# EAGLE design keyer (EAGLE 7.5.0)
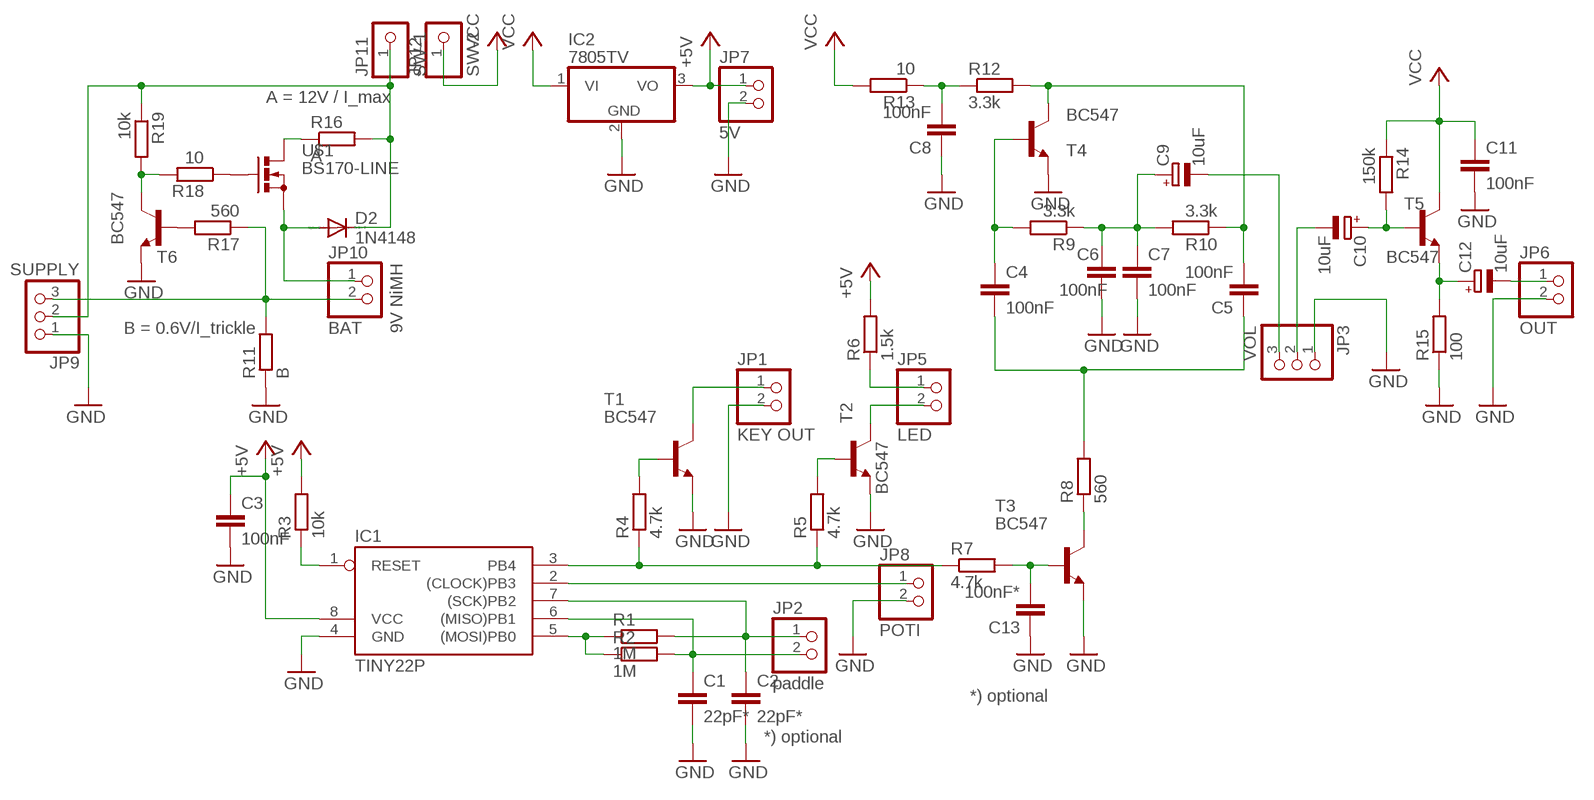
[diagram p0: schematic, sheet 1]

## Parts
C1  22pF*  C-EU050-025X075  [C050-025X075]
C2  22pF*  C-EU050-025X075  [C050-025X075]
C3  100nF  C-EU075-032X103  [C075-032X103]
C4  100nF  C-EU025-025X050  [C025-025X050]
C5  100nF  C-EU025-025X050  [C025-025X050]
C6  100nF  C-EU025-025X050  [C025-025X050]
C7  100nF  C-EU025-025X050  [C025-025X050]
C8  100nF  C-EU025-025X050  [C025-025X050]
C9  10uF  CPOL-EUE2.5-6  [E2,5-6]
C10  10uF  CPOL-EUE2.5-6  [E2,5-6]
C11  100nF  C-EU025-025X050  [C025-025X050]
C12  10uF  CPOL-EUE2.5-6  [E2,5-6]
C13  100nF*  C-EU025-025X050  [C025-025X050]
D2  1N4148  DIODE-D-2.5  [D-2.5]
IC1  TINY22P  [DIL08]
IC2  7805TV  [TO220V]
JP1  KEY OUT  PINHD-1X2  [1X02]
JP2  paddle  PINHD-1X2  [1X02]
JP3  VOL  PINHD-1X3  [1X03]
JP5  LED  PINHD-1X2  [1X02]
JP6  OUT  PINHD-1X2  [1X02]
JP7  5V  PINHD-1X2  [1X02]
JP8  POTI  PINHD-1X2  [1X02]
JP9  SUPPLY  PINHD-1X3  [1X03]
JP10  BAT  PINHD-1X2  [1X02]
JP11  SW-1  PINHD-1X1  [1X01]
JP12  SW-2  PINHD-1X1  [1X01]
R1  1M  R-EU_0204/5  [0204/5]
R2  1M  R-EU_0204/2V  [0204V]
R3  10k  R-EU_0204/5  [0204/5]
R4  4.7k  R-EU_0204/5  [0204/5]
R5  4.7k  R-EU_0204/5  [0204/5]
R6  1.5k  R-EU_0204/5  [0204/5]
R7  4.7k  R-EU_0204/5  [0204/5]
R8  560  R-EU_0204/2V  [0204V]
R9  3.3k  R-EU_0204/5  [0204/5]
R10  3.3k  R-EU_0204/7  [0204/7]
R11  B  R-EU_0204/5  [0204/5]
R12  3.3k  R-EU_0204/5  [0204/5]
R13  10  R-EU_0204/2V  [0204V]
R14  150k  R-EU_0204/2V  [0204V]
R15  100  R-EU_0204/7  [0204/7]
R16  A  R-EU_0204/2V  [0204V]
R17  560  R-EU_0204/5  [0204/5]
R18  10  R-EU_0204/5  [0204/5]
R19  10k  R-EU_0204/2V  [0204V]
T1  BC547  -NPN-TO92-CBE  [TO92-CBE]
T2  BC547  -NPN-TO92-CBE  [TO92-CBE]
T3  BC547  -NPN-TO92-CBE  [TO92-CBE]
T4  BC547  -NPN-TO92-CBE  [TO92-CBE]
T5  BC547  -NPN-TO92-CBE  [TO92-CBE]
T6  BC547  -NPN-TO92-CBE  [TO92-CBE]
U$1  BS170-LINE  [TO92-LINE]

## Nets
+5V: C3.1 IC1.8(VCC) IC2.3(VO) JP7.1 R3.2 R6.2
GND: C1.2 C2.2 C3.2 C6.2 C7.2 C8.1 C11.2 C13.1 IC1.4(GND) IC2.2(GND) JP1.2 JP3.1 JP6.2 JP7.2 JP8.2 JP9.1 R11.1 R15.1 T1.E T2.E T3.E T4.E T6.E
N$1: IC1.5((MOSI)PB0) R1.1 R2.1
N$2: C2.1 IC1.7((SCK)PB2) JP2.1 R1.2
N$3: C1.1 IC1.6((MISO)PB1) JP2.2 R2.2
N$4: IC1.1(RESET) R3.1
N$5: IC1.2((CLOCK)PB3) JP8.1
N$6: R4.2 T1.B
N$7: JP1.1 T1.C
N$8: IC1.3(PB4) R4.1 R5.1 R7.1
N$9: R8.1 T3.C
N$10: R5.2 T2.B
N$11: JP5.2 T2.C
N$12: JP5.1 R6.1
N$13: C4.1 R9.2 T4.B
N$14: C13.2 R7.2 T3.B
N$15: C5.2 R10.1 R12.2 T4.C
N$16: JP9.3 JP10.2 R11.2 R17.1
N$17: C6.1 C7.1 C9.+ R9.1 R10.2
N$18: C4.2 C5.1 R8.2
N$19: C8.2 R12.1 R13.1
N$20: C9.- JP3.3
N$21: C10.- JP3.2
N$22: C10.+ R14.2 T5.B
N$23: C12.+ R15.2 T5.E
N$24: C12.- JP6.1
N$25: R17.2 T6.B
N$26: D2.A JP10.1 U$1.1(S)
N$27: R16.1 U$1.3(D)
N$28: R18.1 U$1.2(G)
N$29: R18.2 R19.2 T6.C
N$30: D2.C JP9.2 JP11.1 R16.2 R19.1
VCC: C11.1 IC2.1(VI) JP12.1 R13.2 R14.1 T5.C

## Notes on the sheet
- A = 12V / I_max
- 9V NiMH
- B = 0.6V/I_trickle
- *) optional
- *) optional

## Library data of the parts
C1-C8 C11 C13 = rcl:C-EU: CAPACITOR, European symbol
C9 C10 C12 = rcl:CPOL-EU: POLARIZED CAPACITOR, European symbol
D2 = diode:DIODE-: DIODE
IC1 = atmel:TINY22: MICROCONTROLLER 1K ROM 128 bytes RAM 128 bytes EEPROM; OC_FARNELL: unknown; OC_NEWARK: unknown
IC2 = linear:78*: Positive VOLTAGE REGULATOR Source: http://cache.national.com/ds/LM/LM78L05.pdf http://www.fairchildsemi.com/ds/LM/LM7805.pdf
JP1 JP2 JP5-JP8 JP10 = pinhead:PINHD-1X2: PIN HEADER
JP3 JP9 = pinhead:PINHD-1X3: PIN HEADER
JP11 JP12 = pinhead:PINHD-1X1: PIN HEADER
R1-R19 = rcl:R-EU_: RESISTOR, European symbol
T1-T6 = transistor-neu-to92:*-NPN-: NPN Transistror
U$1 = transistor-small-signal:BS170-LINE

## Board
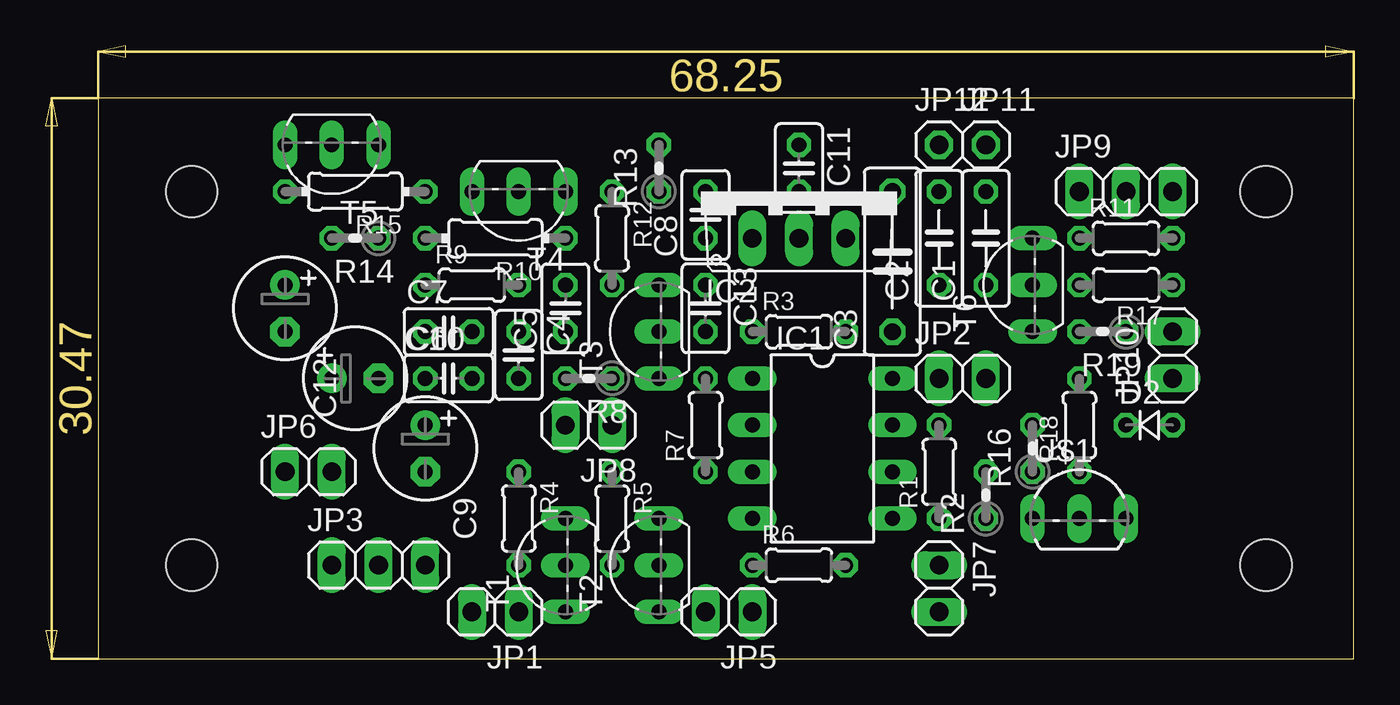
[diagram p1: board, top side]
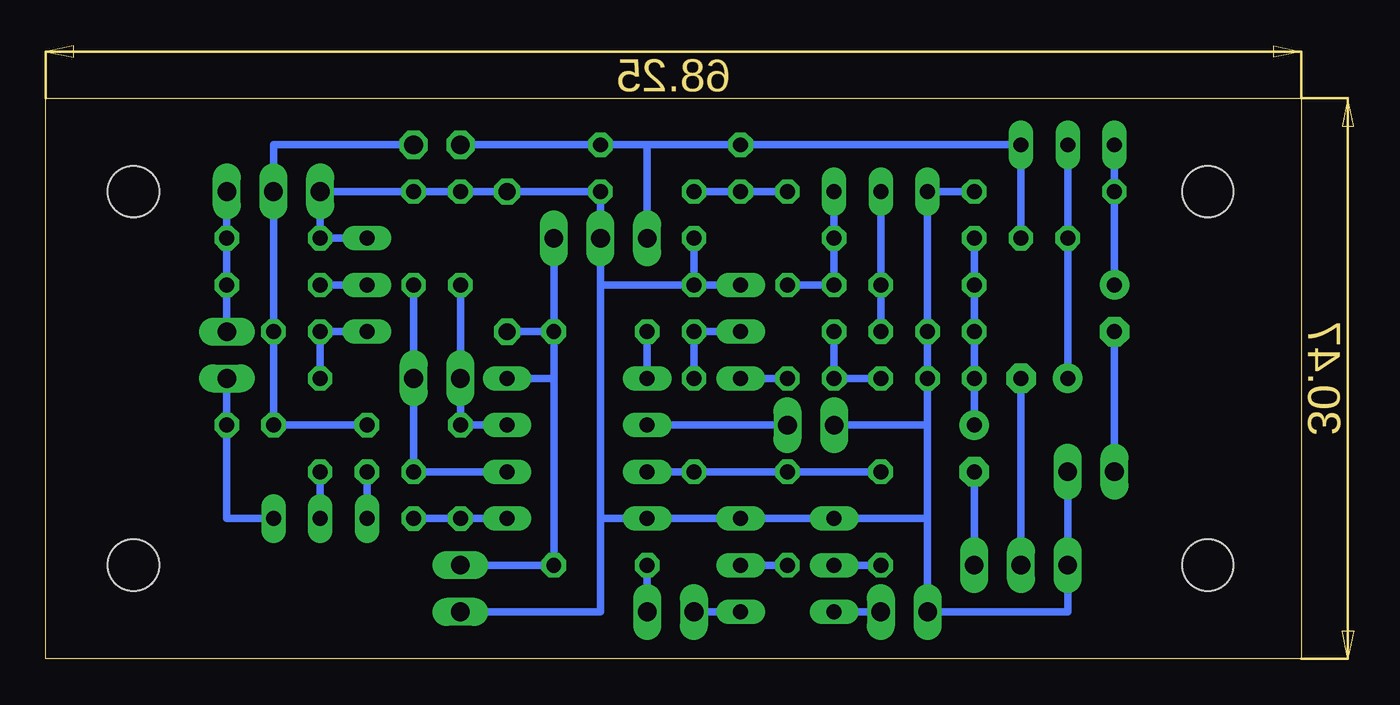
[diagram p2: board, bottom side, seen from below]

Size 68.25 x 30.47 mm. Coordinates in mm from the lower left corner, seen from the top.
Outline: 0,0 68.25,0 68.25,30.47 0,30.47 0,0
Copper layers (1*16): Top 0.035mm / dielectric 1.5mm / Bottom 0.035mm
Design rules "default": minimum track width 10mil, minimum drill 24mil, track to track 8mil, track to pad 8mil, pad to pad 8mil, via to via 8mil, smd to smd 8mil, copper to edge 40mil, drill to drill 8mil, minimum pad ring 10mil, minimum via ring 8mil, stop-mask expansion 4mil, vias tented up to drill 0mil, thermal gap 10mil
Holes 2.8 mm at 5.08,5.08 5.08,25.4 63.5,5.08 63.5,25.4

### Footprints (pad centres in the part's own frame; a part is rotated, then mirrored left to right if it is on the bottom)
C050-025X075 = drill 0.813 octagon: 1 -2.54,0; 2 2.54,0
C075-032X103 = drill 0.914 octagon: 1 -3.81,0; 2 3.81,0
C025-025X050 = drill 0.813 octagon: 1 -1.27,0; 2 1.27,0
E2,5-6 = drill 0.813 pad 1.6: + -1.27,0 | drill 0.813 pad 1.6 octagon: - 1.27,0
D-2.5 = drill 0.813 octagon: A 1.27,0; C -1.27,0
DIL08 = drill 0.813 long: 1 -3.81,-3.81; 2 -1.27,-3.81; 3 1.27,-3.81; 4 3.81,-3.81; 5 3.81,3.81; 6 1.27,3.81; 7 -1.27,3.81; 8 -3.81,3.81
TO220V = drill 1.016 long: 1 -2.54,-2.54; 2 0,-2.54; 3 2.54,-2.54
1X02 = drill 1.016 long: 1 -1.27,0; 2 1.27,0
1X03 = drill 1.016 long: 1 -2.54,0; 2 0,0; 3 2.54,0
1X01 = drill 1.016 octagon: 1 0,0
0204/5 = drill 0.813 octagon: 1 -2.54,0; 2 2.54,0
0204V = drill 0.813 octagon: 1 -1.27,0; 2 1.27,0
0204/7 = drill 0.813 octagon: 1 -3.81,0; 2 3.81,0
TO92-CBE = drill 0.813 long: B 0,0; C -2.54,0; E 2.54,0
TO92-LINE = drill 0.813 long: 1 2.54,0; 2 0,0; 3 -2.54,0

### Placement (x,y rotation side)
C1  48.26,22.86 90 top
C2  45.72,22.86 90 top
C3  43.18,21.59 90 top
C4  22.86,16.51 270 top
C5  25.4,19.05 90 top
C6  19.05,15.24 0 top
C7  19.05,17.78 0 top
C8  33.02,24.13 90 top
C9  17.78,11.43 270 top
C10  13.97,15.24 0 top
C11  38.1,26.67 270 top
C12  10.16,19.05 270 top
C13  33.02,19.05 270 top
D2  57.15,12.7 0 top
IC1  39.37,11.43 270 top
IC2  38.1,25.4 0 top
JP1  21.59,2.54 180 top
JP2  46.99,15.24 0 top
JP3  15.24,5.08 0 top
JP5  34.29,2.54 180 top
JP6  11.43,10.16 0 top
JP7  45.72,3.81 270 top
JP8  26.67,12.7 180 top
JP9  55.88,25.4 0 top
JP10  58.42,16.51 90 top
JP11  48.26,27.94 0 top
JP12  45.72,27.94 0 top
R1  45.72,10.16 90 top
R2  48.26,8.89 90 top
R3  38.1,17.78 0 top
R4  22.86,7.62 270 top
R5  27.94,7.62 270 top
R6  38.1,5.08 0 top
R7  33.02,12.7 90 top
R8  26.67,15.24 180 top
R9  20.32,20.32 0 top
R10  21.59,22.86 180 top
R11  55.88,22.86 0 top
R12  27.94,22.86 270 top
R13  30.48,26.67 90 top
R14  13.97,22.86 180 top
R15  13.97,25.4 180 top
R16  50.8,11.43 90 top
R17  55.88,20.32 180 top
R18  53.34,12.7 90 top
R19  54.61,17.78 180 top
T1  25.4,5.08 90 top
T2  30.48,5.08 90 top
T3  30.48,17.78 90 top
T4  22.86,25.4 180 top
T5  12.7,27.94 180 top
T6  50.8,20.32 90 top
U$1  53.34,7.62 0 top

### Tracks (layer width: path | path; a pad name or v marks a point on that pad's centre or on a via)
+5V
  Bottom 0.406: IC1.8 40.64,15.24 | 40.64,15.24 R6.2 JP7.1 | R3.2 IC2.3 | R3.2 40.64,15.24 | C3.1 R3.2
GND
  Bottom 0.406: 38.1,7.62 IC1.4 T2.E T1.E 20.32,7.62 | 38.1,7.62 38.1,20.32 | 38.1,20.32 IC2.2 C11.2 C3.2 C2.2 C1.2 JP9.1 R11.1 T6.E | 20.32,7.62 20.32,12.7 | 20.32,7.62 JP1.2 12.7,2.54 JP3.1 JP6.2 | R15.1 T4.E C7.2 C6.2 20.32,12.7 | JP8.2 20.32,12.7 | JP7.2 38.1,2.54 38.1,7.62 | T3.E C13.1 | C13.1 38.1,20.32 | C13.1 C8.1
N$1
  Bottom 0.406: IC1.5 R1.1 R2.1
N$2
  Bottom 0.406: IC1.7 R1.2 C2.1 JP2.1
N$3
  Bottom 0.406: IC1.6 R2.2 C1.1 JP2.2
N$4
  Bottom 0.406: IC1.1 R3.1
N$5
  Bottom 0.406: JP8.1 IC1.2
N$6
  Bottom 0.406: R4.2 T1.B
N$7
  Bottom 0.406: JP1.1 T1.C
N$8
  Bottom 0.406: IC1.3 R7.1 R5.1 R4.1
N$9
  Bottom 0.406: R8.1 T3.C
N$10
  Bottom 0.406: T2.B R5.2
N$11
  Bottom 0.406: JP5.2 T2.C
N$12
  Bottom 0.406: R6.1 JP5.1
N$13
  Bottom 0.406: T4.B C4.1 R9.2
N$14
  Bottom 0.406: T3.B C13.2 R7.2
N$15
  Bottom 0.406: R12.2 C5.2 R10.1 T4.C
N$16
  Bottom 0.406: JP10.2 R17.1 R11.2 JP9.3
N$17
  Bottom 0.406: R9.1 C6.1 C7.1 R9.1 | C9.+ R9.1 | R10.2 R9.1
N$18
  Bottom 0.406: C4.2 R8.2 C5.1
N$19
  Bottom 0.406: R12.1 C8.2 R13.1
N$20
  Bottom 0.406: JP3.3 C9.-
N$21
  Bottom 0.406: JP3.2 C10.-
N$22
  Bottom 0.406: C10.+ 12.7,20.32 R14.2 T5.B
N$23
  Bottom 0.406: T5.E R15.2 C12.+
N$24
  Bottom 0.406: JP6.1 C12.-
N$25
  Bottom 0.406: T6.B R17.2
N$26
  Bottom 0.406: JP10.1 D2.A 58.42,7.62 U$1.1
N$27
  Bottom 0.406: R16.1 U$1.3
N$28
  Bottom 0.406: R18.1 U$1.2
N$29
  Bottom 0.406: T6.C R19.2 R18.2
N$30
  Bottom 0.406: JP11.1 55.88,27.94 JP9.2 R19.1 D2.C R16.2
VCC
  Bottom 0.406: IC2.1 35.56,27.94 | 35.56,27.94 R13.2 T5.C R14.1 | 35.56,27.94 C11.1 JP12.1